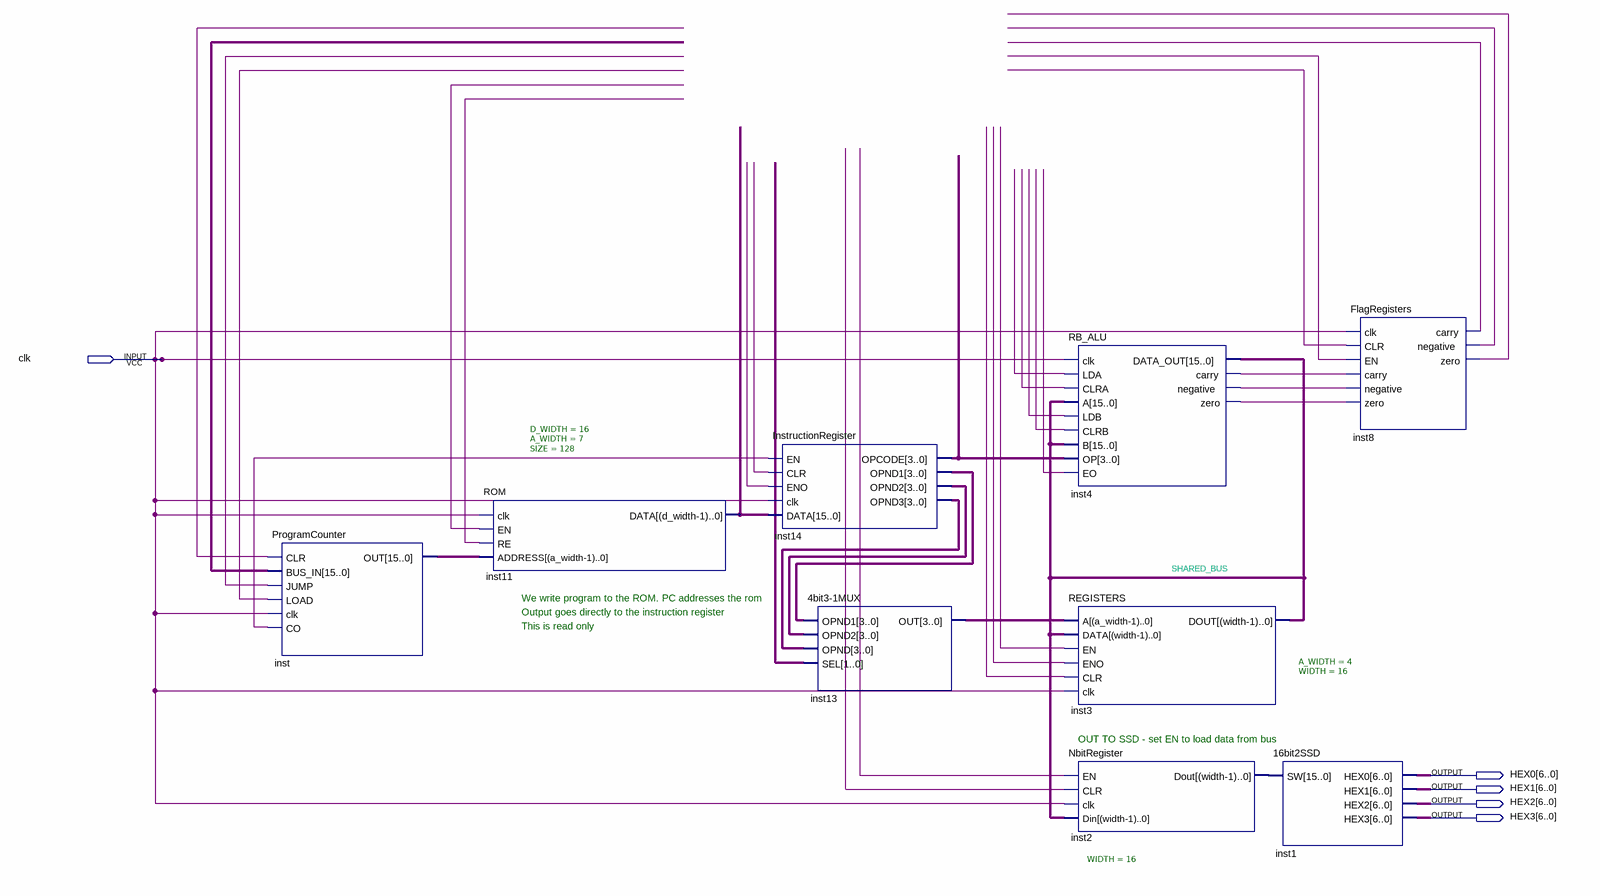
[diagram p0: schematic sheet]
// Quartus schematic BasicCPU.bdf as structural Verilog: 9 symbols, 5 pins
module BasicCPU (
  input  clk,
  output [6:0] HEX0,
  output [6:0] HEX1,
  output [6:0] HEX2,
  output [6:0] HEX3
);

  wire inst4_carry, inst4_negative, inst4_zero, inst8_carry, inst8_negative, inst8_zero, SHARED_BUS,
       undriven, undriven_2, undriven_4, undriven_5, undriven_6, undriven_7, undriven_8, undriven_10,
       undriven_11, undriven_12, undriven_13, undriven_14, undriven_15, undriven_16, undriven_17,
       undriven_18, undriven_19, undriven_20, undriven_21, undriven_22;
  wire [1:0] undriven_9;
  wire [3:0] inst13_out, inst14_opcode, inst14_opnd1, inst14_opnd2, inst14_opnd3;
  wire [15:0] inst2_dout, inst11_data, inst_out, undriven_3;

  ProgramCounter inst (
    .CLR(undriven_4), .BUS_IN(undriven_3), .JUMP(undriven_7), .LOAD(undriven_2), .clk(clk), .CO(undriven),
    .OUT(inst_out));
  ROM #(.D_WIDTH(16), .A_WIDTH(7), .SIZE(128)) inst11 (
    .clk(clk), .EN(undriven_6), .RE(undriven_5), .ADDRESS(inst_out), .DATA(inst11_data));
  InstructionRegister inst14 (
    .EN(undriven), .CLR(undriven_20), .ENO(undriven_8), .clk(clk), .DATA(inst11_data),
    .OPCODE(inst14_opcode), .OPND1(inst14_opnd1), .OPND2(inst14_opnd2), .OPND3(inst14_opnd3));
  \4bit3-1MUX  inst13 (
    .OPND1(inst14_opnd1), .OPND2(inst14_opnd2), .OPND(inst14_opnd3), .SEL(undriven_9), .OUT(inst13_out));
  RB_ALU inst4 (
    .clk(clk), .LDA(undriven_17), .CLRA(undriven_16), .A({16{SHARED_BUS}}), .LDB(undriven_15),
    .CLRB(undriven_14), .B({16{SHARED_BUS}}), .OP(inst14_opcode), .EO(undriven_10), .DATA_OUT(SHARED_BUS),
    .carry(inst4_carry), .negative(inst4_negative), .zero(inst4_zero));
  REGISTERS #(.A_WIDTH(4), .WIDTH(16)) inst3 (
    .A(inst13_out), .DATA({16{SHARED_BUS}}), .EN(undriven_11), .ENO(undriven_12), .CLR(undriven_13),
    .clk(clk), .DOUT(SHARED_BUS));
  NbitRegister #(.WIDTH(16)) inst2 (
    .EN(undriven_19), .CLR(undriven_18), .clk(clk), .Din({16{SHARED_BUS}}), .Dout(inst2_dout));
  \16bit2SSD  inst1 (.SW(inst2_dout), .HEX0(HEX0), .HEX1(HEX1), .HEX2(HEX2), .HEX3(HEX3));
  FlagRegisters inst8 (
    .clk(clk), .CLR(undriven_22), .EN(undriven_21), .carry({inst4_carry, inst8_carry}),
    .negative({inst4_negative, inst8_negative}), .zero({inst4_zero, inst8_zero}));

  // Notes on the sheet:
  //   We write program to the ROM. PC addresses the rom
  //   Output goes directly to the instruction register
  //   This is read only
  //   OUT TO SSD - set EN to load data from bus
endmodule
